# EAGLE schematic Metvoc2.0 (EAGLE 9.1.3)
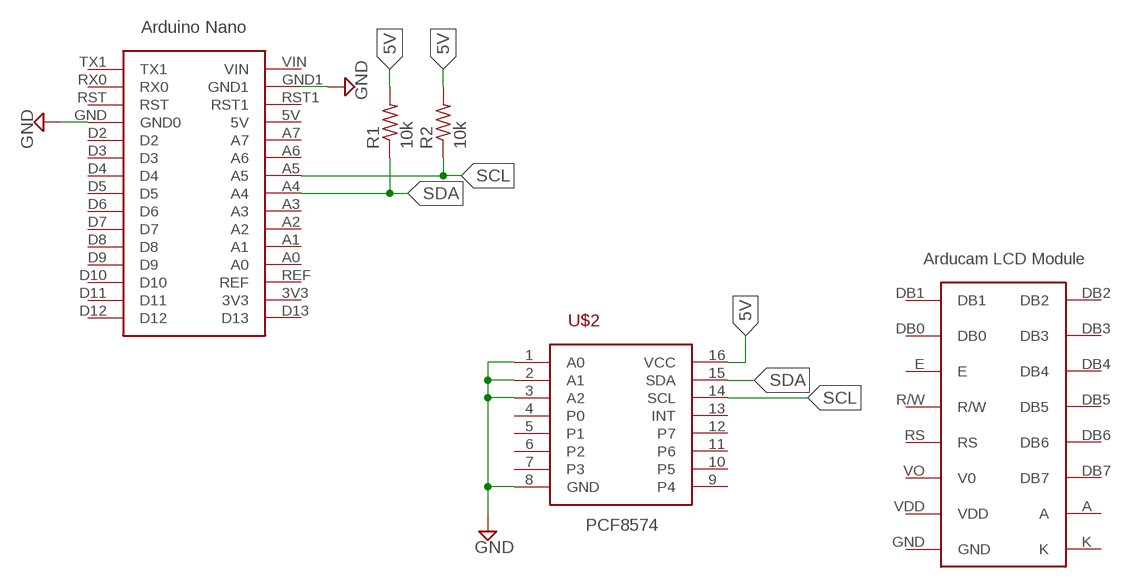
[diagram p0: schematic, sheet 1]

## Parts
R1  10k  R-US_M1206  [M1206]
R2  10k  R-US_M1206  [M1206]
U$1  ARDUINO_NANO  [ARDUINONANO]
U$2  PCF8574  [SO16]
U$3  LCDMODULE  [LCDSCREEN]

## Nets
5V: R1.2 R2.2 U$2.16(VCC)
GND: U$1.GND1 U$1.GND(GND0) U$2.1(A0) U$2.2(A1) U$2.3(A2) U$2.8(GND)
SCL: R2.1 U$1.A5 U$2.14(SCL)
SDA: R1.1 U$1.A4 U$2.15(SDA)
Unconnected: U$1.3V3 U$1.5V U$1.A0 U$1.A1 U$1.A2 U$1.A3 U$1.A6 U$1.A7 U$1.D2 U$1.D3 U$1.D4 U$1.D5 U$1.D6 U$1.D7 U$1.D8 U$1.D9 U$1.D10 U$1.D11 U$1.D12 U$1.D13 U$1.REF U$1.RST U$1.RST1 U$1.RX0 U$1.TX1 U$1.VIN U$2.4(P0) U$2.5(P1) U$2.6(P2) U$2.7(P3) U$2.9(P4) U$2.10(P5) U$2.11(P6) U$2.12(P7) U$2.13(INT) U$3.A U$3.DB0 U$3.DB1 U$3.DB2 U$3.DB3 U$3.DB4 U$3.DB5 U$3.DB6 U$3.DB7 U$3.E U$3.GND U$3.K U$3.R/W U$3.RS U$3.VDD U$3.VO(V0)

## Library data of the parts
R1 R2 = resistor:R-US_: RESISTOR, American symbol
U$1 = Metvoc:ARDUINO_NANO
U$2 = Metvoc2.0:PCF8574: PCF8574: I2C GPIO Expander Specifications: Manufacturer: Texas Instruments Number of I/O: 8 Output Type: Push-Pull Interface: I2C Clock Frequency: 100 kHz Voltage - Supply: 2.5 - 6 V Datasheet: PCF8574DWR <http://www.ti.com/lit/ds/symlink/pcf8574.pdf> Digi-Key Part #: 296-13108-1-ND <https://www.digikey.com/product-detail/en/texas-instruments/PCF8574DWR/296-13108-1-ND/484579>
U$3 = Metvoc:LCDMODULE